# Altium schematic sheet LED Driver and Switches.SchDoc
size A2; SheetNumber: 2; SheetTotal: 2
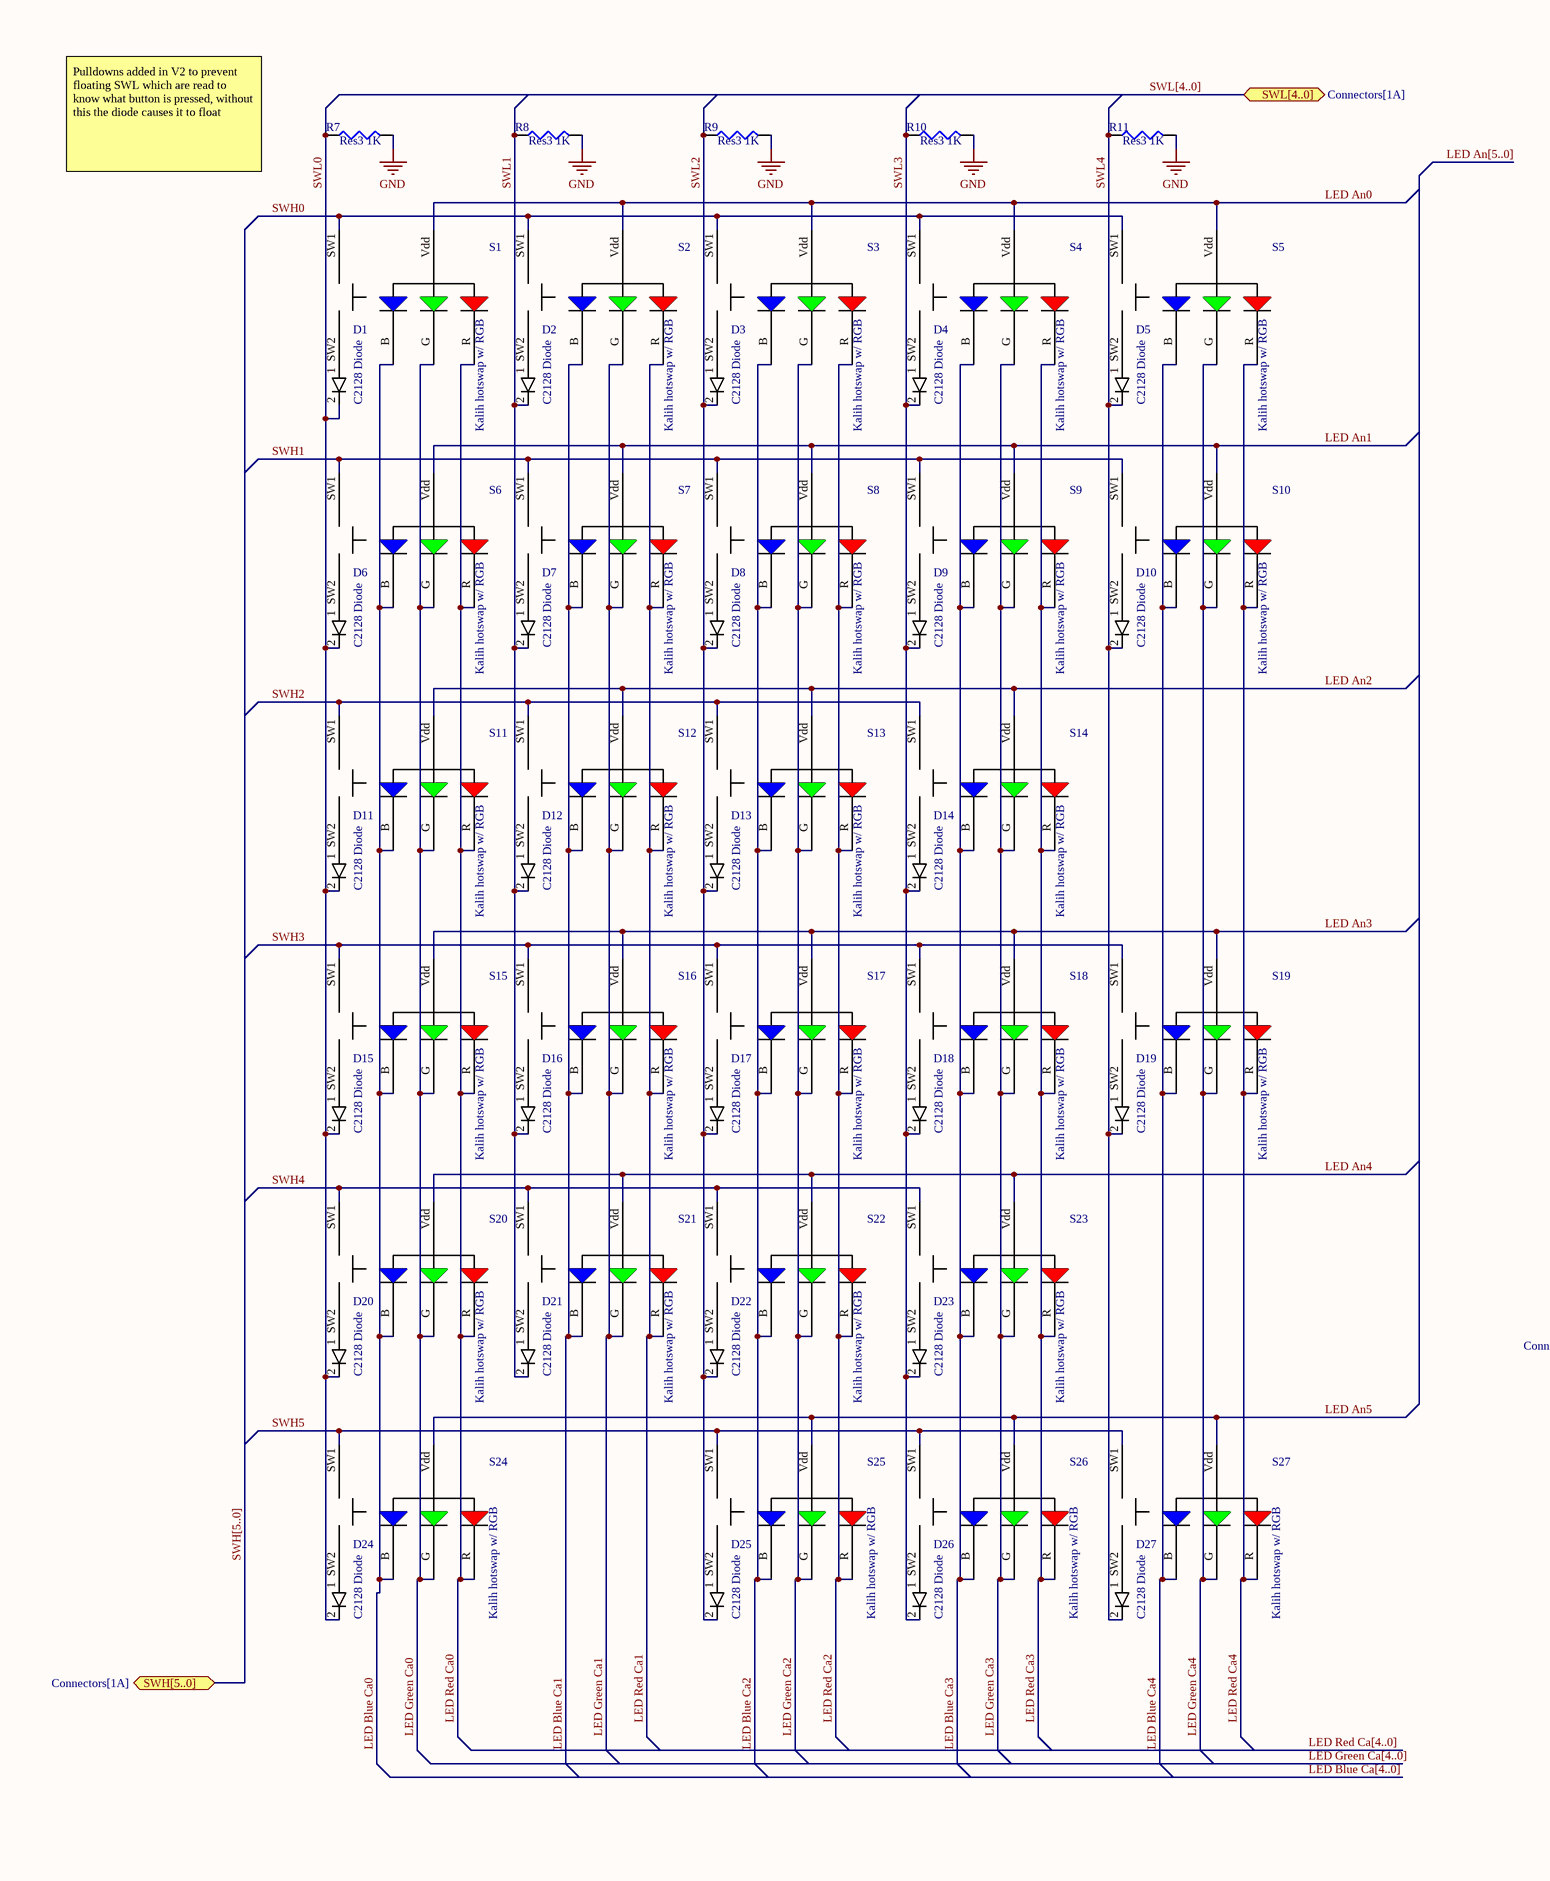
[diagram p0: LED Driver and Switches.SchDoc, left]
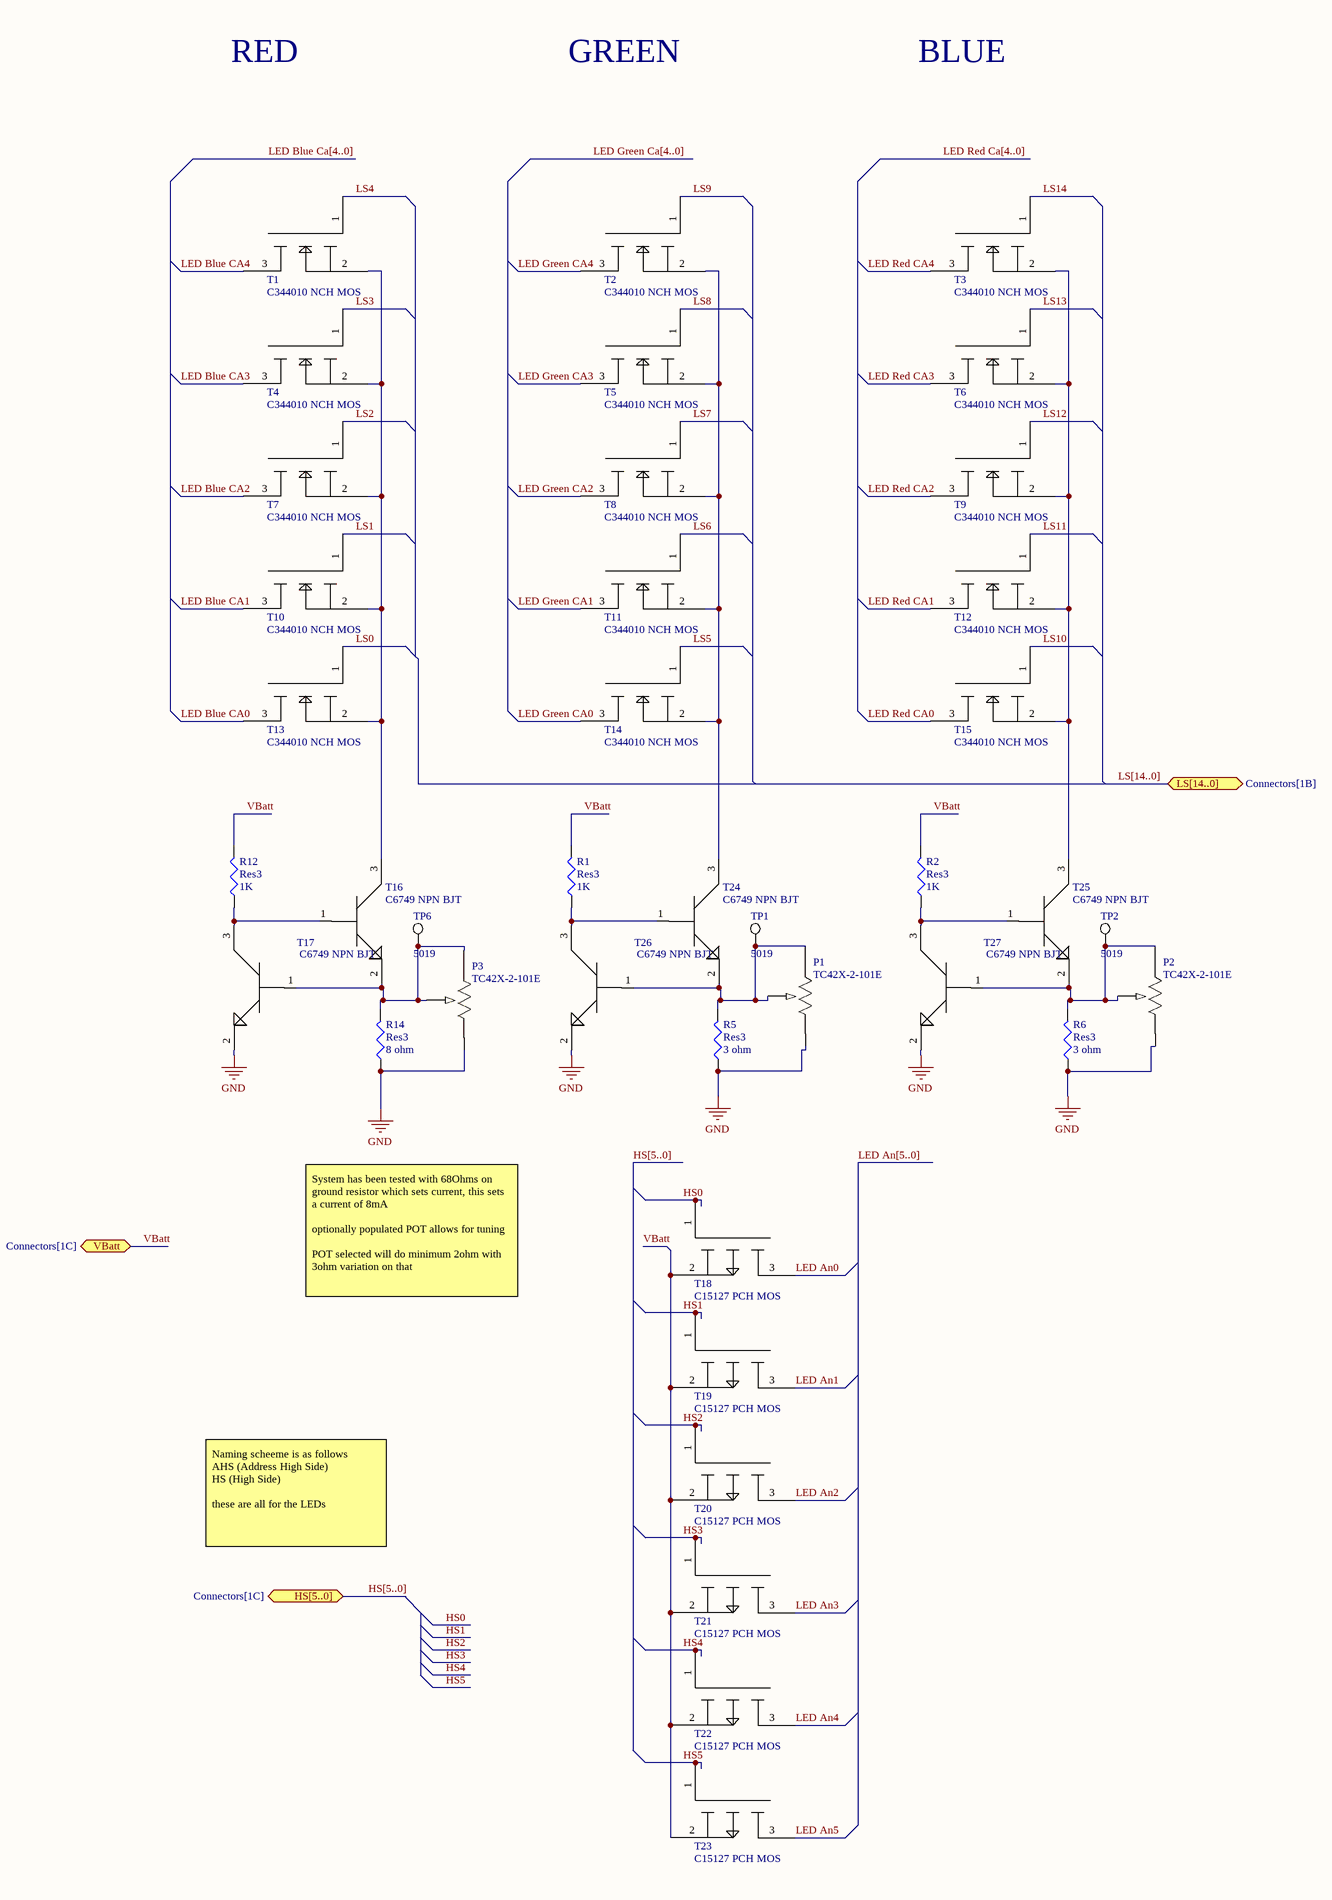
[diagram p1: LED Driver and Switches.SchDoc, right]

## Parts
D1  C2128 Diode  [C2128 SOD323]
D2  C2128 Diode  [C2128 SOD323]
D3  C2128 Diode  [C2128 SOD323]
D4  C2128 Diode  [C2128 SOD323]
D5  C2128 Diode  [C2128 SOD323]
D6  C2128 Diode  [C2128 SOD323]
D7  C2128 Diode  [C2128 SOD323]
D8  C2128 Diode  [C2128 SOD323]
D9  C2128 Diode  [C2128 SOD323]
D10  C2128 Diode  [C2128 SOD323]
D11  C2128 Diode  [C2128 SOD323]
D12  C2128 Diode  [C2128 SOD323]
D13  C2128 Diode  [C2128 SOD323]
D14  C2128 Diode  [C2128 SOD323]
D15  C2128 Diode  [C2128 SOD323]
D16  C2128 Diode  [C2128 SOD323]
D17  C2128 Diode  [C2128 SOD323]
D18  C2128 Diode  [C2128 SOD323]
D19  C2128 Diode  [C2128 SOD323]
D20  C2128 Diode  [C2128 SOD323]
D21  C2128 Diode  [C2128 SOD323]
D22  C2128 Diode  [C2128 SOD323]
D23  C2128 Diode  [C2128 SOD323]
D24  C2128 Diode  [C2128 SOD323]
D25  C2128 Diode  [C2128 SOD323]
D26  C2128 Diode  [C2128 SOD323]
D27  C2128 Diode  [C2128 SOD323]
P1  TC42X-2-101E  [TC42X-2-101E]
P2  TC42X-2-101E  [TC42X-2-101E]
P3  TC42X-2-101E  [TC42X-2-101E]
R1  Res3  value 1K  [J1-0603]
R2  Res3  value 1K  [J1-0603]
R5  Res3  value 3 ohm  [J1-0603]
R6  Res3  value 3 ohm  [J1-0603]
R7  Res3  value 1K  [J1-0603]
R8  Res3  value 1K  [J1-0603]
R9  Res3  value 1K  [J1-0603]
R10  Res3  value 1K  [J1-0603]
R11  Res3  value 1K  [J1-0603]
R12  Res3  value 1K  [J1-0603]
R14  Res3  value 8 ohm  [J1-0603]
S1  Kalih hotswap w/ RGB  [Kalih Hotswap smd]
S2  Kalih hotswap w/ RGB  [Kalih Hotswap smd]
S3  Kalih hotswap w/ RGB  [Kalih Hotswap smd]
S4  Kalih hotswap w/ RGB  [Kalih Hotswap smd]
S5  Kalih hotswap w/ RGB  [Kalih Hotswap smd]
S6  Kalih hotswap w/ RGB  [Kalih Hotswap smd]
S7  Kalih hotswap w/ RGB  [Kalih Hotswap smd]
S8  Kalih hotswap w/ RGB  [Kalih Hotswap smd]
S9  Kalih hotswap w/ RGB  [Kalih Hotswap smd]
S10  Kalih hotswap w/ RGB  [Kalih Hotswap smd]
S11  Kalih hotswap w/ RGB  [Kalih Hotswap smd]
S12  Kalih hotswap w/ RGB  [Kalih Hotswap smd]
S13  Kalih hotswap w/ RGB  [Kalih Hotswap smd]
S14  Kalih hotswap w/ RGB  [Kalih Hotswap smd]
S15  Kalih hotswap w/ RGB  [Kalih Hotswap smd]
S16  Kalih hotswap w/ RGB  [Kalih Hotswap smd]
S17  Kalih hotswap w/ RGB  [Kalih Hotswap smd]
S18  Kalih hotswap w/ RGB  [Kalih Hotswap smd]
S19  Kalih hotswap w/ RGB  [Kalih hotswap smd stabilizer V]
S20  Kalih hotswap w/ RGB  [Kalih Hotswap smd]
S21  Kalih hotswap w/ RGB  [Kalih Hotswap smd]
S22  Kalih hotswap w/ RGB  [Kalih Hotswap smd]
S23  Kalih hotswap w/ RGB  [Kalih Hotswap smd]
S24  Kalih hotswap w/ RGB  [Kalih Hotswap smd]
S25  Kalih hotswap w/ RGB  [Kalih hotswap smd stabilizer H]
S26  Kalih hotswap w/ RGB  [Kalih Hotswap smd]
S27  Kalih hotswap w/ RGB  [Kalih hotswap smd stabilizer V]
T1  C344010 NCH MOS  [C6749 NPN BJT]
T2  C344010 NCH MOS  [C6749 NPN BJT]
T3  C344010 NCH MOS  [C6749 NPN BJT]
T4  C344010 NCH MOS  [C6749 NPN BJT]
T5  C344010 NCH MOS  [C6749 NPN BJT]
T6  C344010 NCH MOS  [C6749 NPN BJT]
T7  C344010 NCH MOS  [C6749 NPN BJT]
T8  C344010 NCH MOS  [C6749 NPN BJT]
T9  C344010 NCH MOS  [C6749 NPN BJT]
T10  C344010 NCH MOS  [C6749 NPN BJT]
T11  C344010 NCH MOS  [C6749 NPN BJT]
T12  C344010 NCH MOS  [C6749 NPN BJT]
T13  C344010 NCH MOS  [C6749 NPN BJT]
T14  C344010 NCH MOS  [C6749 NPN BJT]
T15  C344010 NCH MOS  [C6749 NPN BJT]
T16  C6749 NPN BJT  [C6749 NPN BJT]
T17  C6749 NPN BJT  [C6749 NPN BJT]
T18  C15127 PCH MOS  [C6749 NPN BJT]
T19  C15127 PCH MOS  [C6749 NPN BJT]
T20  C15127 PCH MOS  [C6749 NPN BJT]
T21  C15127 PCH MOS  [C6749 NPN BJT]
T22  C15127 PCH MOS  [C6749 NPN BJT]
T23  C15127 PCH MOS  [C6749 NPN BJT]
T24  C6749 NPN BJT  [C6749 NPN BJT]
T25  C6749 NPN BJT  [C6749 NPN BJT]
T26  C6749 NPN BJT  [C6749 NPN BJT]
T27  C6749 NPN BJT  [C6749 NPN BJT]
TP1  5019  [KSTN-5019_V]
TP2  5019  [KSTN-5019_V]
TP6  5019  [KSTN-5019_V]

## Ports
HS[5..0] (bidir, see Connectors[1C]), LS[14..0] (bidir, see Connectors[1B]), SWH[5..0] (bidir, see Connectors[1A]), SWL[4..0] (bidir, see Connectors[1A]), VBatt (bidir, see Connectors[1C])

## Nets
GND: P1.1 P2.1 P3.1 R5.1 R6.1 R7.2 R8.2 R9.2 R10.2 R11.2 R14.1 T17.2 T26.2 T27.2
HS0: T18.1
HS1: T19.1
HS2: T20.1
HS3: T21.1
HS4: T22.1
HS5: T23.1
LED An0: S1.Vdd(COM) S2.Vdd(COM) S3.Vdd(COM) S4.Vdd(COM) S5.Vdd(COM) T18.3
LED An1: S6.Vdd(COM) S7.Vdd(COM) S8.Vdd(COM) S9.Vdd(COM) S10.Vdd(COM) T19.3
LED An2: S11.Vdd(COM) S12.Vdd(COM) S13.Vdd(COM) S14.Vdd(COM) T20.3
LED An3: S15.Vdd(COM) S16.Vdd(COM) S17.Vdd(COM) S18.Vdd(COM) S19.Vdd(COM) T21.3
LED An4: S20.Vdd(COM) S21.Vdd(COM) S22.Vdd(COM) S23.Vdd(COM) T22.3
LED An5: S24.Vdd(COM) S25.Vdd(COM) S26.Vdd(COM) S27.Vdd(COM) T23.3
LED Blue Ca0: S1.B S6.B S11.B S15.B S20.B S24.B T13.3
LED Blue Ca1: S2.B S7.B S12.B S16.B S21.B T10.3
LED Blue Ca2: S3.B S8.B S13.B S17.B S22.B S25.B T7.3
LED Blue Ca3: S4.B S9.B S14.B S18.B S23.B S26.B T4.3
LED Blue Ca4: S5.B S10.B S19.B S27.B T1.3
LED Green Ca0: S1.G S6.G S11.G S15.G S20.G S24.G T14.3
LED Green Ca1: S2.G S7.G S12.G S16.G S21.G T11.3
LED Green Ca2: S3.G S8.G S13.G S17.G S22.G S25.G T8.3
LED Green Ca3: S4.G S9.G S14.G S18.G S23.G S26.G T5.3
LED Green Ca4: S5.G S10.G S19.G S27.G T2.3
LED Red Ca0: S1.R S6.R S11.R S15.R S20.R S24.R T15.3
LED Red Ca1: S2.R S7.R S12.R S16.R S21.R T12.3
LED Red Ca2: S3.R S8.R S13.R S17.R S22.R S25.R T9.3
LED Red Ca3: S4.R S9.R S14.R S18.R S23.R S26.R T6.3
LED Red Ca4: S5.R S10.R S19.R S27.R T3.3
LS0: T13.1
LS1: T10.1
LS2: T7.1
LS3: T4.1
LS4: T1.1
LS5: T14.1
LS6: T11.1
LS7: T8.1
LS8: T5.1
LS9: T2.1
LS10: T15.1
LS11: T12.1
LS12: T9.1
LS13: T6.1
LS14: T3.1
SWH0: S1.SW1 S2.SW1 S3.SW1 S4.SW1 S5.SW1
SWH1: S6.SW1 S7.SW1 S8.SW1 S9.SW1 S10.SW1
SWH2: S11.SW1 S12.SW1 S13.SW1 S14.SW1
SWH3: S15.SW1 S16.SW1 S17.SW1 S18.SW1 S19.SW1
SWH4: S20.SW1 S21.SW1 S22.SW1 S23.SW1
SWH5: S24.SW1 S25.SW1 S26.SW1 S27.SW1
SWL0: D1.2 D6.2 D11.2 D15.2 D20.2 D24.2 R7.1
SWL1: D2.2 D7.2 D12.2 D16.2 D21.2 R8.1
SWL2: D3.2 D8.2 D13.2 D17.2 D22.2 D25.2 R9.1
SWL3: D4.2 D9.2 D14.2 D18.2 D23.2 D26.2 R10.1
SWL4: D5.2 D10.2 D19.2 D27.2 R11.1
VBatt: R1.2 R2.2 R12.2 T18.2 T19.2 T20.2 T21.2 T22.2 T23.2 ; port VBatt
NetD1_1: D1.1 S1.SW2
NetD2_1: D2.1 S2.SW2
NetD3_1: D3.1 S3.SW2
NetD4_1: D4.1 S4.SW2
NetD5_1: D5.1 S5.SW2
NetD6_1: D6.1 S6.SW2
NetD7_1: D7.1 S7.SW2
NetD8_1: D8.1 S8.SW2
NetD9_1: D9.1 S9.SW2
NetD10_1: D10.1 S10.SW2
NetD11_1: D11.1 S11.SW2
NetD12_1: D12.1 S12.SW2
NetD13_1: D13.1 S13.SW2
NetD14_1: D14.1 S14.SW2
NetD15_1: D15.1 S15.SW2
NetD16_1: D16.1 S16.SW2
NetD17_1: D17.1 S17.SW2
NetD18_1: D18.1 S18.SW2
NetD19_1: D19.1 S19.SW2
NetD20_1: D20.1 S20.SW2
NetD21_1: D21.1 S21.SW2
NetD22_1: D22.1 S22.SW2
NetD23_1: D23.1 S23.SW2
NetD24_1: D24.1 S24.SW2
NetD25_1: D25.1 S25.SW2
NetD26_1: D26.1 S26.SW2
NetD27_1: D27.1 S27.SW2
NetP1_2: P1.2 P1.3 R5.2 T24.2 T26.1 TP1.1
NetP2_2: P2.2 P2.3 R6.2 T25.2 T27.1 TP2.1
NetP3_2: P3.2 P3.3 R14.2 T16.2 T17.1 TP6.1
NetR1_1: R1.1 T24.1 T26.3
NetR2_1: R2.1 T25.1 T27.3
NetR12_1: R12.1 T16.1 T17.3
NetT1_2: T1.2 T4.2 T7.2 T10.2 T13.2 T16.3
NetT2_2: T2.2 T5.2 T8.2 T11.2 T14.2 T24.3
NetT3_2: T3.2 T6.2 T9.2 T12.2 T15.2 T25.3

## Buses and harness runs
bus HS[5..0]
bus HS[5..0] = port HS[5..0]
bus LED An[5..0]
bus LED Blue Ca[4..0]
bus LED Green Ca[4..0]
bus LED Red Ca[4..0]
bus LS[14..0] = port LS[14..0]
bus SWH[5..0] = port SWH[5..0]
bus SWL[4..0] = port SWL[4..0]

## Notes on the sheet
- RED
- GREEN
- BLUE
- Pulldowns added in V2 to prevent floating SWL which are read to know what button is pressed, without this the diode causes it to float
- System has been tested with 68Ohms on ground resistor which sets current, this sets a current of 8mA
  optionally populated POT allows for tuning
  POT selected will do minimum 2ohm with 3ohm variation on that
- Naming scheeme is as follows
  AHS (Address High Side)
  HS (High Side)
  these are all for the LEDs

## Library data of the parts
P1-P3 = TC42X-2-101E: low profile pot
R1 R2 R5-R12 R14 = Res3: Resistor; Published: 8-Jun-2000; LatestRevisionDate: 29-May-2009; LatestRevisionNote: IPC-7351 Footprint Added.; PackageReference: J1-0603; Publisher: Altium Limited; PackageDescription: Chip Resistor
S1-S27 = Kalih hotswap smd
TP1 TP2 TP6 = CMP-1672-00008-1: Test Point, 1 Position SMD, RoHS, Tape and Reel; ComponentLink1Description: Manufacturer URL; Package Quantity: 1000; DatasheetVersion: 03/2014; Packaging: Tape and Reel; ComponentLink2URL: http://www.keyelco.com/product-pdf.cfm?p=1357; ComponentLink1URL: http://www.keyelco.com/; Mount: Surface Mount; Contact Plating: Silver; PackageDescription: 1-Pin Surface Mount Device, Body 3.81 x 2.03 mm; Pins: 1; RoHSCompliant: True; Mounting Technology: Surface Mount; ComponentLink2Description: Datasheet; PackageReference: 5019